# Altium schematic sheet DisPlay_Switch_Interface.SchDoc
size A4
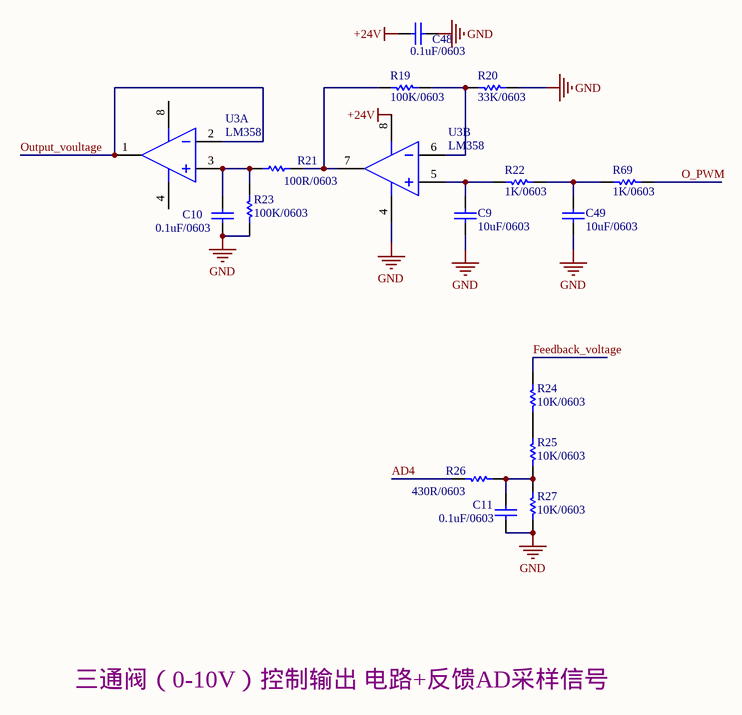
[diagram p0: DisPlay_Switch_Interface.SchDoc]

## Parts
C9  10uF/0603  [CAP/SMT/0603C]
C10  0.1uF/0603  [CAP/SMT/0603C]
C11  0.1uF/0603  [CAP/SMT/0603C]
C48  0.1uF/0603  [CAP/SMT/0603C]
C49  10uF/0603  [CAP/SMT/0603C]
R19  100K/0603  [0603R]
R20  33K/0603  [0603R]
R21  100R/0603  [0603R]
R22  1K/0603  [0603R]
R23  100K/0603  [0603R]
R24  10K/0603  [0603R]
R25  10K/0603  [0603R]
R26  430R/0603  [0603R]
R27  10K/0603  [0603R]
R69  1K/0603  [0603R]
U3  LM358  [SOIC-8]  (parts A,B of 2)

## Nets
+24V: C48.2 U3.8(VCC)
GND: C9.1 C10.1 C11.1 C48.1 C49.1 R20.1 R23.2 R27.1 U3.4(GND)
AD4: R26.1
Feedback_voltage: R24.2
O_PWM: R69.1
Output_voultage: U3.1(OUT) U3.2(IN-)
NetC9_2: C9.2 R22.2 U3.5(IN+)
NetC10_2: C10.2 R21.1 R23.1 U3.3(IN+)
NetC11_2: C11.2 R25.1 R26.2 R27.2
NetC49_2: C49.2 R22.1 R69.2
NetR19_1: R19.1 R20.2 U3.6(IN-)
NetR19_2: R19.2 R21.2 U3.7(OUT)
NetR24_1: R24.1 R25.2

## Notes on the sheet
- Labels drawn without touching a wire or pin: 三通阀（0-10V）控制输出 电路+反馈AD采样信号

## Library data of the parts
C9-C11 C48 C49 = CAP/CAP/SMT/0603C
R19-R27 R69 = RES/RES/SMT/0603
U3 = IC/OP/SMT/SGM358YS/SOIC-8: 1MHz 60uA Rail-to-Rail i/o CMOS OP; Manufacturer: ST-Microelectronics; Class: Analog; SubClass: Comparator; Published: 24/08/2001; Publisher: Altium Hobart Technology Centre